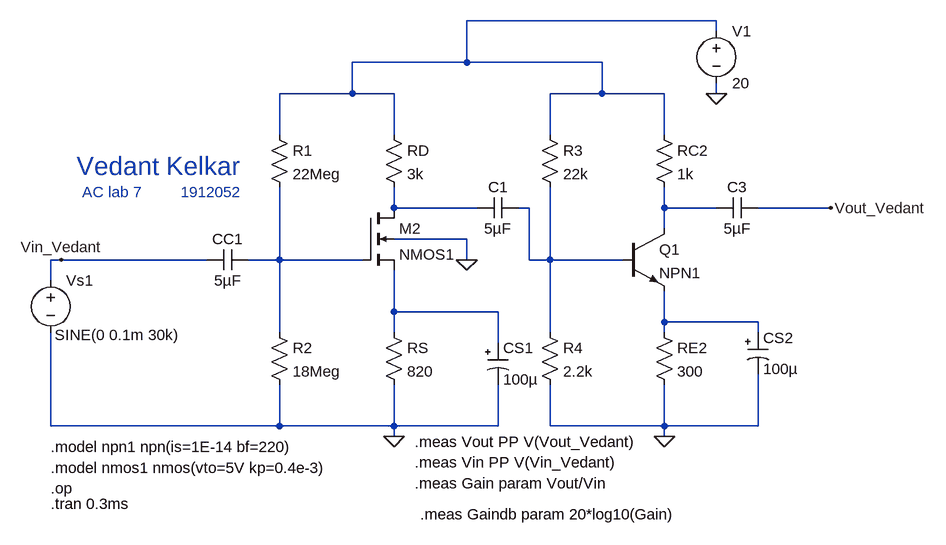
[diagram p0: schematic AC2_lab7.asc]
AC2_lab7.asc, the LTspice schematic file:
Version 4
SHEET 1 880 680
WIRE 464 -256 80 -256
WIRE 464 -240 464 -256
WIRE 80 -192 80 -256
WIRE 80 -192 -96 -192
WIRE 288 -192 80 -192
WIRE -96 -144 -96 -192
WIRE -96 -144 -208 -144
WIRE -32 -144 -96 -144
WIRE 288 -144 288 -192
WIRE 288 -144 208 -144
WIRE 384 -144 288 -144
WIRE 464 -144 464 -160
WIRE -208 -80 -208 -144
WIRE -32 -80 -32 -144
WIRE 208 -80 208 -144
WIRE 384 -80 384 -144
WIRE -32 32 -32 0
WIRE 96 32 -32 32
WIRE 176 32 160 32
WIRE 384 32 384 0
WIRE 464 32 384 32
WIRE 640 32 528 32
WIRE 384 64 384 32
WIRE 80 80 -32 80
WIRE -544 112 -560 112
WIRE -320 112 -544 112
WIRE -208 112 -208 0
WIRE -208 112 -256 112
WIRE -80 112 -208 112
WIRE 80 112 80 80
WIRE 176 112 176 32
WIRE 208 112 208 0
WIRE 208 112 176 112
WIRE 320 112 208 112
WIRE -560 144 -560 112
WIRE -32 192 -32 128
WIRE 128 192 -32 192
WIRE 384 208 384 160
WIRE 528 208 384 208
WIRE -208 224 -208 112
WIRE -32 224 -32 192
WIRE 208 224 208 112
WIRE 384 224 384 208
WIRE 528 224 528 208
WIRE 128 240 128 192
WIRE -560 368 -560 224
WIRE -208 368 -208 304
WIRE -208 368 -560 368
WIRE -32 368 -32 304
WIRE -32 368 -208 368
WIRE 128 368 128 304
WIRE 128 368 -32 368
WIRE 208 368 208 304
WIRE 384 368 384 304
WIRE 384 368 208 368
WIRE 528 368 528 288
WIRE 528 368 384 368
WIRE -32 384 -32 368
WIRE 384 384 384 368
FLAG -32 384 0
FLAG 384 384 0
FLAG 464 -144 0
FLAG 80 112 0
FLAG 640 32 Vout_Vedant
FLAG -544 112 Vin_Vedant
SYMBOL res -224 -96 R0
SYMATTR InstName R1
SYMATTR Value 22Meg
SYMBOL res -48 -96 R0
SYMATTR InstName RD
SYMATTR Value 3k
SYMBOL res -48 208 R0
SYMATTR InstName RS
SYMATTR Value 820
SYMBOL res -224 208 R0
SYMATTR InstName R2
SYMATTR Value 18Meg
SYMBOL npn 320 64 R0
SYMATTR InstName Q1
SYMATTR Value NPN1
SYMBOL cap -256 96 R90
WINDOW 0 0 32 VBottom 2
WINDOW 3 32 32 VTop 2
SYMATTR InstName CC1
SYMATTR Value 5µF
SYMBOL cap 160 16 R90
WINDOW 0 0 32 VBottom 2
WINDOW 3 32 32 VTop 2
SYMATTR InstName C1
SYMATTR Value 5µF
SYMBOL polcap 112 240 R0
WINDOW 3 24 56 Left 2
SYMATTR Value 100µ
SYMATTR InstName CS1
SYMATTR Description Capacitor
SYMATTR Type cap
SYMATTR SpiceLine V=4 Irms=3.72678 Rser=0.018 Lser=0 mfg="KEMET" pn="A700D107M004ATE018" type="Al electrolytic"
SYMBOL res 192 -96 R0
SYMATTR InstName R3
SYMATTR Value 22k
SYMBOL res 192 208 R0
SYMATTR InstName R4
SYMATTR Value 2.2k
SYMBOL res 368 -96 R0
SYMATTR InstName RC2
SYMATTR Value 1k
SYMBOL res 368 208 R0
SYMATTR InstName RE2
SYMATTR Value 300
SYMBOL cap 528 16 R90
WINDOW 0 0 32 VBottom 2
WINDOW 3 32 32 VTop 2
SYMATTR InstName C3
SYMATTR Value 5µF
SYMBOL polcap 512 224 R0
WINDOW 3 24 56 Left 2
SYMATTR Value 100µ
SYMATTR InstName CS2
SYMATTR Description Capacitor
SYMATTR Type cap
SYMATTR SpiceLine V=4 Irms=3.72678 Rser=0.018 Lser=0 mfg="KEMET" pn="A700D107M004ATE018" type="Al electrolytic"
SYMBOL voltage 464 -256 R0
WINDOW 123 0 0 Left 0
WINDOW 39 0 0 Left 0
SYMATTR InstName V1
SYMATTR Value 20
SYMBOL nmos4 -80 32 R0
SYMATTR InstName M2
SYMATTR Value NMOS1
SYMBOL voltage -560 128 R0
WINDOW 123 22 92 Left 2
WINDOW 39 0 0 Left 0
WINDOW 3 6 100 Left 2
SYMATTR Value SINE(0 0.1m 30k)
SYMATTR InstName Vs1
TEXT -520 -32 Left 4 ;Vedant Kelkar
TEXT -512 8 Left 2 ;AC lab 7
TEXT -360 8 Left 2 ;1912052
TEXT -560 400 Left 2 !.model npn1 npn(is=1E-14 bf=220)
TEXT -560 432 Left 2 !.model nmos1 nmos(vto=5V kp=0.4e-3)
TEXT -560 464 Left 2 !.op
TEXT -560 488 Left 2 !.tran 0.3ms
TEXT 0 392 Left 2 !.meas Vout PP V(Vout_Vedant)
TEXT 0 424 Left 2 !.meas Vin PP V(Vin_Vedant)
TEXT 0 456 Left 2 !.meas Gain param Vout/Vin
TEXT 8 504 Left 2 !.meas Gaindb param 20*log10(Gain)

The netlist it stands for:
* AC2_lab7.asc
R1 N001 N005 22Meg
RD N001 N002 3k
RS N006 0 820
R2 N005 0 18Meg
Q1 N004 N003 N007 0 NPN1
CC1 N005 Vin_Vedant 5µF
C1 N003 N002 5µF
CS1 N006 0 100µ V=4 Irms=3.72678 Rser=0.018 Lser=0 mfg="KEMET" pn="A700D107M004ATE018" type="Al electrolytic"
R3 N001 N003 22k
R4 N003 0 2.2k
RC2 N001 N004 1k
RE2 N007 0 300
C3 Vout_Vedant N004 5µF
CS2 N007 0 100µ V=4 Irms=3.72678 Rser=0.018 Lser=0 mfg="KEMET" pn="A700D107M004ATE018" type="Al electrolytic"
V1 N001 0 20
M2 N002 N005 N006 0 NMOS1
Vs1 Vin_Vedant 0 SINE(0 0.1m 30k)
.model NPN NPN
.model PNP PNP
.lib standard.bjt
.model NMOS NMOS
.model PMOS PMOS
.lib standard.mos
* Vedant Kelkar
* AC lab 7
* 1912052
.model npn1 npn(is=1E-14 bf=220)
.model nmos1 nmos(vto=5V kp=0.4e-3)
.op
.tran 0.3ms
.meas Vout PP V(Vout_Vedant)
.meas Vin PP V(Vin_Vedant)
.meas Gain param Vout/Vin
.meas Gaindb param 20*log10(Gain)
.backanno
.end